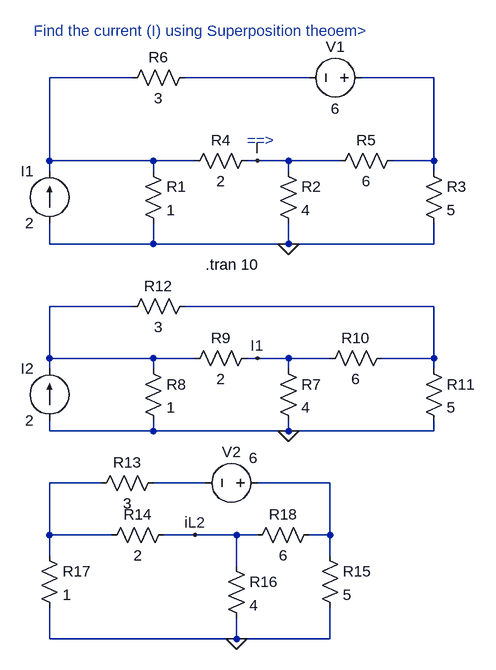
[diagram p0: schematic Lab1_ques3.asc]
Lab1_ques3.asc, the LTspice schematic file:
Version 4
SHEET 1 880 1088
WIRE 192 144 64 144
WIRE 464 144 272 144
WIRE 656 144 544 144
WIRE 64 272 64 144
WIRE 224 272 64 272
WIRE 288 272 224 272
WIRE 384 272 368 272
WIRE 432 272 384 272
WIRE 512 272 432 272
WIRE 656 272 656 144
WIRE 656 272 592 272
WIRE 64 288 64 272
WIRE 224 288 224 272
WIRE 432 288 432 272
WIRE 656 288 656 272
WIRE 64 400 64 368
WIRE 224 400 224 368
WIRE 224 400 64 400
WIRE 432 400 432 368
WIRE 432 400 224 400
WIRE 656 400 656 368
WIRE 656 400 432 400
WIRE 192 496 64 496
WIRE 656 496 272 496
WIRE 64 576 64 496
WIRE 224 576 64 576
WIRE 288 576 224 576
WIRE 384 576 368 576
WIRE 432 576 384 576
WIRE 496 576 432 576
WIRE 656 576 656 496
WIRE 656 576 576 576
WIRE 64 592 64 576
WIRE 224 592 224 576
WIRE 432 592 432 576
WIRE 656 592 656 576
WIRE 64 688 64 672
WIRE 224 688 224 672
WIRE 224 688 64 688
WIRE 432 688 432 672
WIRE 432 688 224 688
WIRE 656 688 656 672
WIRE 656 688 432 688
WIRE 144 768 64 768
WIRE 304 768 224 768
WIRE 496 768 384 768
WIRE 64 848 64 768
WIRE 160 848 64 848
WIRE 288 848 240 848
WIRE 352 848 288 848
WIRE 384 848 352 848
WIRE 496 848 496 768
WIRE 496 848 464 848
WIRE 64 880 64 848
WIRE 496 880 496 848
WIRE 352 896 352 848
WIRE 64 1008 64 960
WIRE 352 1008 352 976
WIRE 352 1008 64 1008
WIRE 496 1008 496 960
WIRE 496 1008 352 1008
FLAG 384 272 I
FLAG 384 576 I1
FLAG 432 400 0
FLAG 432 688 0
FLAG 352 1008 0
FLAG 288 848 iL2
SYMBOL Res 208 272 R0
SYMATTR InstName R1
SYMATTR Value 1
SYMBOL Res 416 272 R0
SYMATTR InstName R2
SYMATTR Value 4
SYMBOL Res 640 272 R0
SYMATTR InstName R3
SYMATTR Value 5
SYMBOL Res 384 256 R90
WINDOW 0 0 56 VBottom 2
WINDOW 3 32 56 VTop 2
SYMATTR InstName R4
SYMATTR Value 2
SYMBOL Res 608 256 R90
WINDOW 0 0 56 VBottom 2
WINDOW 3 32 56 VTop 2
SYMATTR InstName R5
SYMATTR Value 6
SYMBOL Res 288 128 R90
WINDOW 0 0 56 VBottom 2
WINDOW 3 32 56 VTop 2
SYMATTR InstName R6
SYMATTR Value 3
SYMBOL current 64 368 R180
WINDOW 0 24 80 Left 2
WINDOW 3 24 0 Left 2
SYMATTR InstName I1
SYMATTR Value 2
SYMBOL voltage 560 144 R90
WINDOW 0 -32 56 VBottom 2
WINDOW 3 32 56 VTop 2
SYMATTR InstName V1
SYMATTR Value 6
SYMBOL Res 416 576 R0
SYMATTR InstName R7
SYMATTR Value 4
SYMBOL Res 208 576 R0
SYMATTR InstName R8
SYMATTR Value 1
SYMBOL Res 384 560 R90
WINDOW 0 0 56 VBottom 2
WINDOW 3 32 56 VTop 2
SYMATTR InstName R9
SYMATTR Value 2
SYMBOL Res 592 560 R90
WINDOW 0 0 56 VBottom 2
WINDOW 3 32 56 VTop 2
SYMATTR InstName R10
SYMATTR Value 6
SYMBOL Res 640 576 R0
SYMATTR InstName R11
SYMATTR Value 5
SYMBOL current 64 672 R180
WINDOW 0 24 80 Left 2
WINDOW 3 24 0 Left 2
SYMATTR InstName I2
SYMATTR Value 2
SYMBOL Res 288 480 R90
WINDOW 0 0 56 VBottom 2
WINDOW 3 32 56 VTop 2
SYMATTR InstName R12
SYMATTR Value 3
SYMBOL Res 240 752 R90
WINDOW 0 0 56 VBottom 2
WINDOW 3 32 56 VTop 2
SYMATTR InstName R13
SYMATTR Value 3
SYMBOL Res 256 832 R90
WINDOW 0 0 56 VBottom 2
WINDOW 3 32 56 VTop 2
SYMATTR InstName R14
SYMATTR Value 2
SYMBOL Res 480 864 R0
SYMATTR InstName R15
SYMATTR Value 5
SYMBOL Res 336 880 R0
SYMATTR InstName R16
SYMATTR Value 4
SYMBOL Res 480 832 R90
WINDOW 0 0 56 VBottom 2
WINDOW 3 32 56 VTop 2
SYMATTR InstName R18
SYMATTR Value 6
SYMBOL Res 48 864 R0
SYMATTR InstName R17
SYMATTR Value 1
SYMBOL voltage 400 768 R90
WINDOW 0 -32 56 VBottom 2
WINDOW 3 -54 22 VTop 2
SYMATTR InstName V2
SYMATTR Value 6
TEXT 40 72 Left 2 ;Find the current (I) using Superposition theoem>
TEXT 368 240 Left 2 ;==>
TEXT 304 432 Left 2 !.tran 10

The netlist it stands for:
* Lab1_ques3.asc
R1 N001 0 1
R2 I 0 4
R3 N003 0 5
R4 I N001 2
R5 N003 I 6
R6 N002 N001 3
I1 0 N001 2
V1 N003 N002 6
R7 I1 0 4
R8 N004 0 1
R9 I1 N004 2
R10 N005 I1 6
R11 N005 0 5
I2 0 N004 2
R12 N005 N004 3
R13 N007 N006 3
R14 iL2 N006 2
R15 N008 0 5
R16 iL2 0 4
R18 N008 iL2 6
R17 N006 0 1
V2 N008 N007 6
* Find the current (I) using Superposition theoem>
* ==>
.tran 10
.backanno
.end